# EAGLE board InkTime (EAGLE 9.7.0)
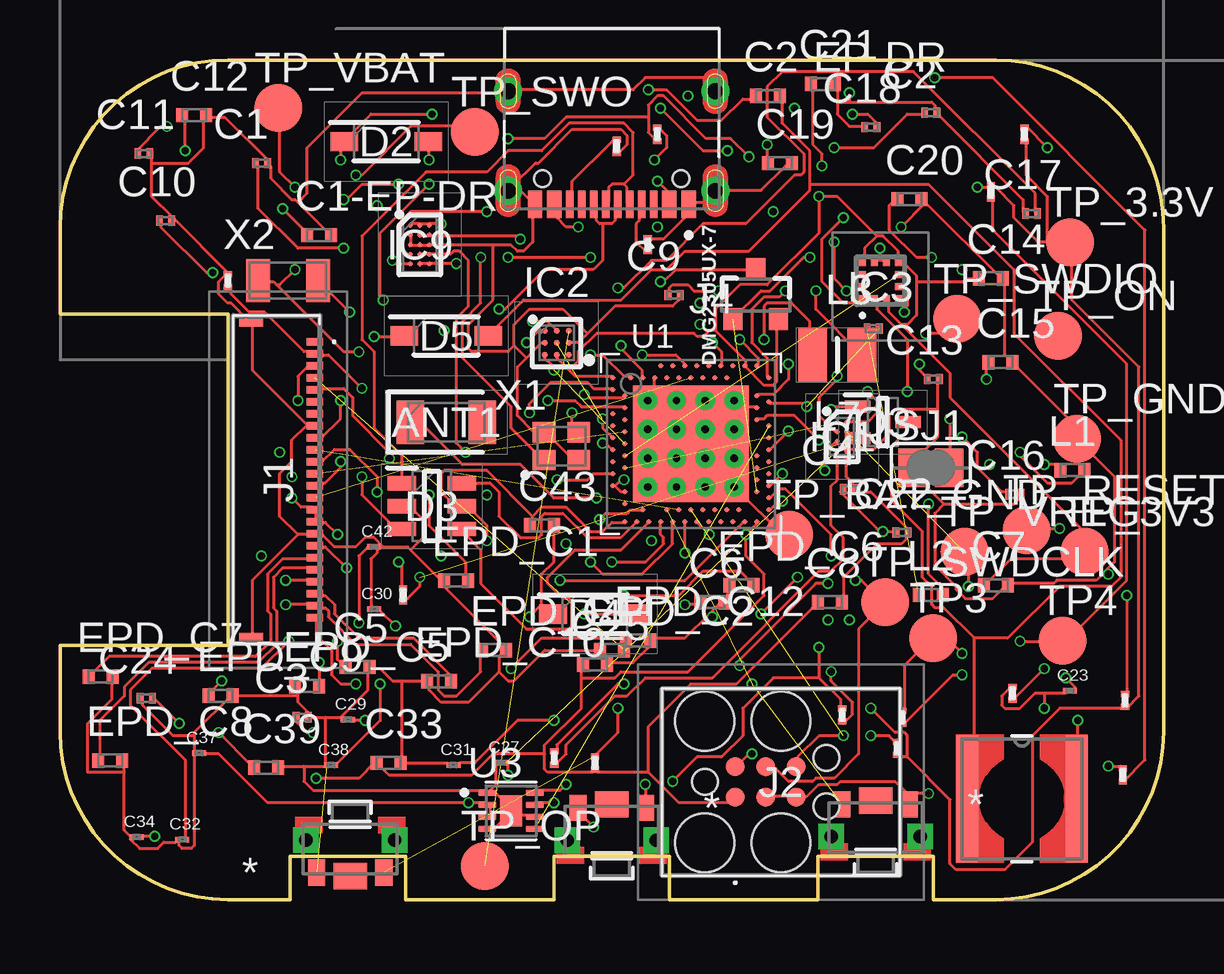
[diagram p2: board, top side]
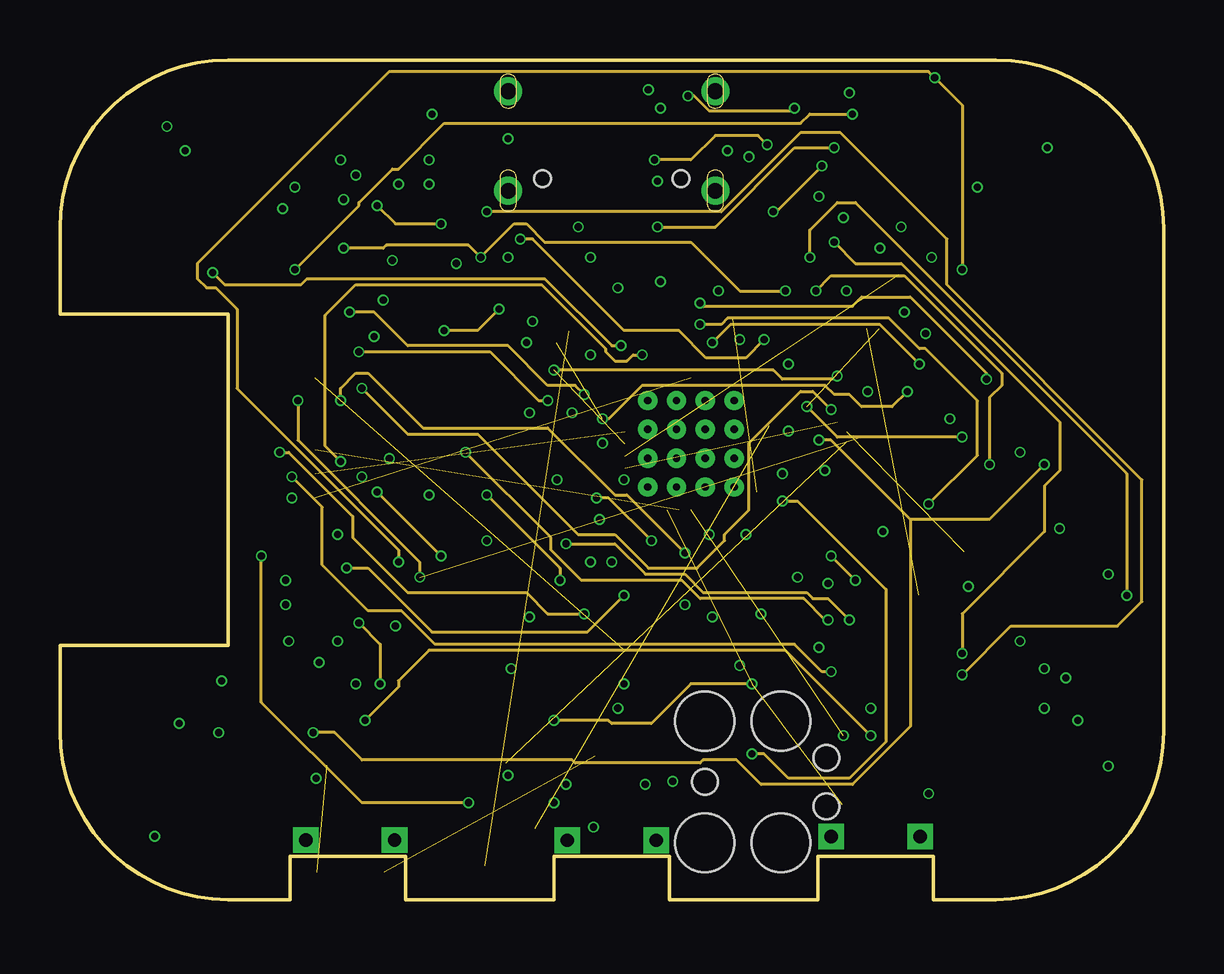
[diagram p3: board, inner layer Route15]
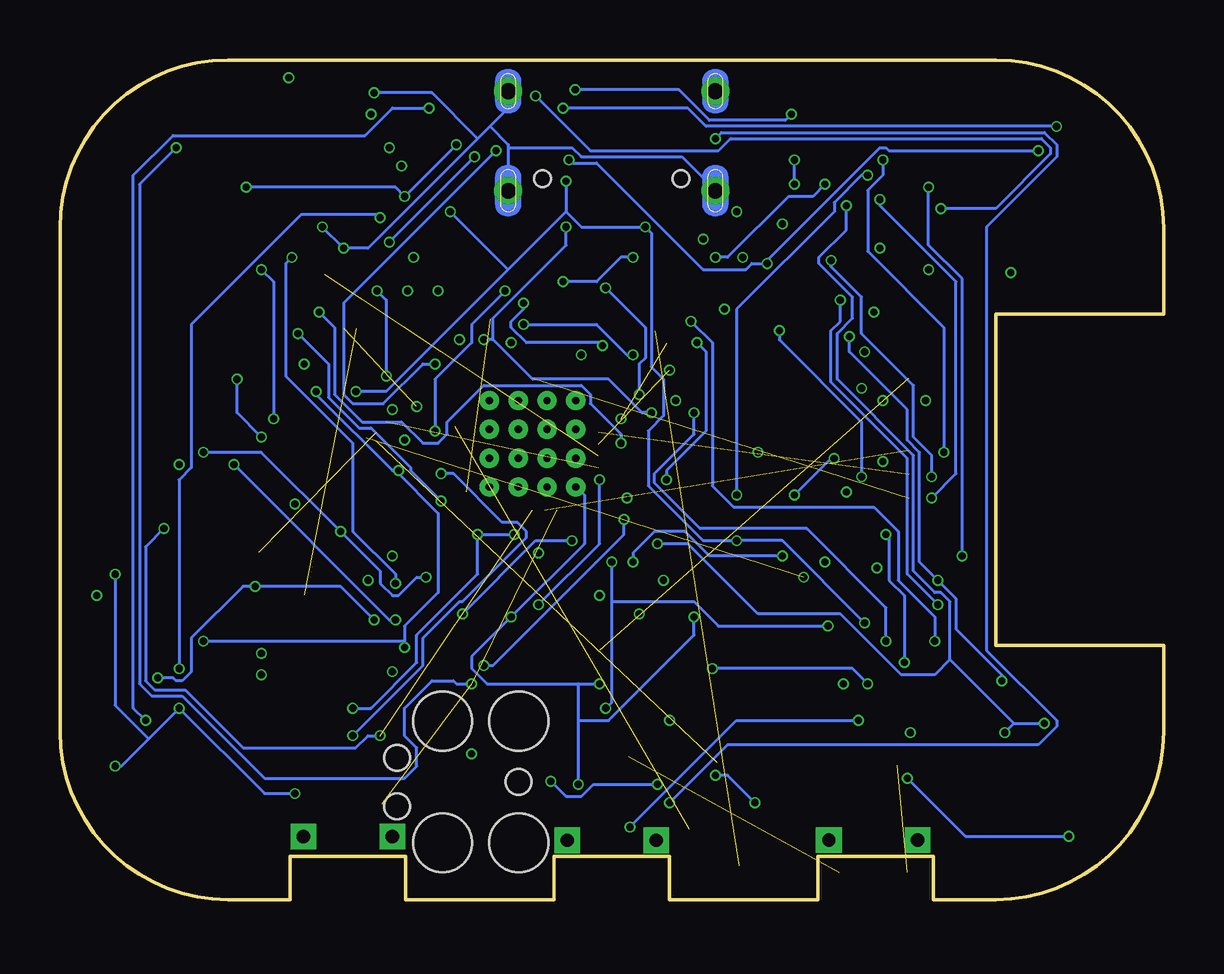
[diagram p4: board, bottom side, seen from below]

Size 46 x 35 mm. Coordinates in mm from the lower left corner, seen from the top.
Outline: 39,0 36.4,0 36.4,1.8 31.6,1.8 31.6,0 25.4,0 25.4,1.8 20.6,1.8 20.6,0 14.4,0 14.4,1.8 9.6,1.8 9.6,0 7,0 arc-90 0,7 0,10.6 7,10.6 7,24.4 0,24.4 0,28 arc-90 7,35 39,35 arc-90 46,28 46,7 arc-90 39,0
Copper layers (1+2*15+16): Top 0.035mm / dielectric 1.6mm / Route2 0.035mm / dielectric 0.15mm / Route15 0.035mm / dielectric 0.2mm / Bottom 0.035mm
Design rules "jlcpcb-2layers.dru *": minimum track width 5mil, minimum drill 0.2mm, track to track 5mil, track to pad 5mil, pad to pad 5mil, via to via 5mil, smd to smd 5mil, copper to edge 0.2mm, drill to drill 6mil, minimum pad ring 10mil, minimum via ring 3mil, stop-mask expansion 4mil, vias tented up to drill 999mm, thermal gap 10mil

## Footprints (pad centres in the part's own frame; a part is rotated, then mirrored left to right if it is on the bottom)
2450AT18B100E_ANTC3216X140N = smd 1.15 x 1.8: 1 -1.5,0; 2 1.5,0
NORDIC_NRF_3_RESC0201_L = smd 0.28 x 0.43: 1 -0.255,0; 2 0.255,0
NORDIC_NRF_3_RESC0402_L = smd 0.5 x 0.6: 1 -0.5,0; 2 0.5,0
GRM011R60J152KE01L_2_CAPC0201X13N = smd 0.22 x 0.23: 1 -0.185,0; 2 0.185,0
ESP32_C6_LIBRARY_5_SOD3716X135N = smd 1.15 x 0.8: 1 -1.75,0; 2 1.75,0
ESP32_C6_LIBRARY_3_SOT95P280X145-6N = smd 1.2 x 0.6: 1 -1.25,0.95; 2 -1.25,0; 3 -1.25,-0.95; 4 1.25,-0.95; 5 1.25,0; 6 1.25,0.95
ESP32_C6_LIBRARY_4_ESP32_C6_LIBRARY_4_ESP32_C6_LIBRARY_4_ESP32_C6_LIBRARY_4_ESP32_WROVER_SPARKFUN-DISCRETESEMI_SOT23-3 = smd 0.8 x 0.9: 1 -0.95,-1; 2 0.95,-1; 3 0,1.1
BQ25180YBGR_BGA8C40P2X4_100X155X50 = smd 0.2 x 0.2: A1 -0.2,0.6; A2 0.2,0.6; B1 -0.2,0.2; B2 0.2,0.2; C1 -0.2,-0.2; C2 0.2,-0.2; D1 -0.2,-0.6; D2 0.2,-0.6
DRV2605YZFR_BGA9C50P3X3_144X144X62 = smd 0.25 x 0.25: A1 -0.5,0.5; A2 0,0.5; A3 0.5,0.5; B1 -0.5,0; B2 0,0; B3 0.5,0; C1 -0.5,-0.5; C2 0,-0.5; C3 0.5,-0.5
BMA423_BMA423 = smd 0.3 x 0.35: 1 -0.75,-0.775; 2 -0.25,-0.775; 3 0.25,-0.775; 4 0.75,-0.775; 7 0.75,0.775; 8 0.25,0.775; 9 -0.25,0.775; 10 -0.75,0.775 | smd 0.35 x 0.3: 5 0.775,-0.25; 6 0.775,0.25; 11 -0.775,0.25; 12 -0.775,-0.25
RT6160AWSC_BGA15C40P3X5_140X230X60 = smd 0.216 x 0.216: A1 -0.4,0.8; A2 0,0.8; A3 0.4,0.8; B1 -0.4,0.4; B2 0,0.4; B3 0.4,0.4; C1 -0.4,0; C2 0,0; C3 0.4,0; D1 -0.4,-0.4; D2 0,-0.4; D3 0.4,-0.4; E1 -0.4,-0.8; E2 0,-0.8; E3 0.4,-0.8
503480-2400_5034802400 = smd 0.3 x 0.7: 1 -5.75,1.525; 2 -5.25,1.525; 3 -4.75,1.525; 4 -4.25,1.525; 5 -3.75,1.525; 6 -3.25,1.525; 7 -2.75,1.525; 8 -2.25,1.525; 9 -1.75,1.525; 10 -1.25,1.525; 11 -0.75,1.525; 12 -0.25,1.525; 13 0.25,1.525; 14 0.75,1.525; 15 1.25,1.525; 16 1.75,1.525; 17 2.25,1.525; 18 2.75,1.525; 19 3.25,1.525; 20 3.75,1.525; 21 4.25,1.525; 22 4.75,1.525; 23 5.25,1.525; 24 5.75,1.525 | smd 0.3 x 1: MP1 -6.54,-1.125; MP2 6.54,-1.125
TC2030-IDC_TC2030IDC = smd 0.783 x 0.783: 1 -0.953,-0.635; 2 -0.953,0.635; 3 0.317,-0.635; 4 0.317,0.635; 5 1.588,-0.635; 6 1.588,0.635 | hole 2.451: -2.223,-2.54; -2.223,2.54; 0.952,-2.54; 0.952,2.54 | hole 1.067: -2.223,0; 2.857,-1.016; 2.857,1.016
KH-TYPE-C-16P_KINGHELM_KH-TYPE-C-16P = smd 0.6 x 1.15: A1_B12 -3.2,4.725; A4_B9 -2.4,4.725; A9_B4 2.4,4.725; A12_B1 3.2,4.725 | smd 0.3 x 1.15: A5 -1.25,4.725; A6 -0.25,4.725; A7 0.25,4.725; A8 1.25,4.725; B5 1.75,4.725; B6 0.75,4.725; B7 -0.75,4.725; B8 -1.75,4.725 | drill 0.65 pad 1.05: SH1 -4.32,0; SH2 4.32,0; SH3 -4.32,4.15; SH4 4.32,4.15 | hole 0.7: -2.89,3.65; 2.89,3.65
NORDIC_NRF_2_RESC0402_L = smd 0.5 x 0.6: 1 -0.5,0; 2 0.5,0
NORDIC_NRF_2_RESC0201_L = smd 0.28 x 0.43: 1 -0.255,0; 2 0.255,0
ESP32_C6_LIBRARY_2_IND_4828-WE-TPC_WRE = smd 0.9 x 5.3: 1 -2.286,0; 2 2.286,0
MLP2016SR47MT0S1_INDC2016X100N = smd 1.2 x 2.2: 1 -1.028,0; 2 1.028,0
ESP32_C6_LIBRARY_6_SOT65P210X110-3N = smd 1.05 x 0.5: 1 -1.05,0.65; 2 -1.05,-0.65; 3 1.05,0
CPF0201D7K68C1_0201 = smd 0.35 x 0.25: 1 0,0.275; 2 0,-0.275
ERA-1AEB3401C_0201 = smd 0.35 x 0.25: 1 0,0.275; 2 0,-0.275
ESP32_C6_LIBRARY_7_JUMPER_SJ = smd 1.168 x 1.6: 1 -0.762,0; 2 0.762,0
2025-10-22_07-23-44_LIBRARY_SW_EVP-AKE31A_PAN = smd 0.711 x 1.092: 1 -1.4,-0.972; 2 1.4,-0.972 | drill 0.559 pad 0.914 square: 3 -1.848,0.381; 4 1.848,0.381 | smd 1.397 x 1.092: 5 0,-1.124
HECTOR_WATCH_1_TP20R = smd 2 x 2: TP 0,0
NORDIC_NRF_4_AQFN50P700X700X85_HS-74N = smd 4.85 x 4.85: P$74 0,0 | drill 0.3 pad 0.6: P$75 -1.8,1.8; P$76 -0.6,1.8; P$77 0.6,1.8; P$78 1.8,1.8; P$79 -1.8,0.6; P$80 -0.6,0.6; P$81 0.6,0.6; P$82 1.8,0.6; P$83 -1.8,-0.6; P$84 -0.6,-0.6; P$85 0.6,-0.6; P$86 1.8,-0.6; P$87 -1.8,-1.8; P$88 -0.6,-1.8; P$89 0.6,-1.8; P$90 1.8,-1.8 | smd 0.2 x 0.2: P$A8 -1.25,3.25; P$A10 -0.75,3.25; P$A12 -0.25,3.25; P$A14 0.25,3.25; P$A16 0.75,3.25; P$A18 1.25,3.25; P$A20 1.75,3.25; P$A22 2.25,3.25; P$A23 2.75,3.25; P$AA24 3.25,-2.25; P$AB2 -2.75,-2.5; P$AC5 -2,-2.75; P$AC9 -1,-2.75; P$AC11 -0.5,-2.75; P$AC13 0,-2.75; P$AC15 0.5,-2.75; P$AC17 1,-2.75; P$AC19 1.5,-2.75; P$AC21 2,-2.75; P$AC24 3.25,-2.75; P$AD2 -2.75,-3.25; P$AD4 -2.25,-3.25; P$AD6 -1.75,-3.25; P$AD8 -1.25,-3.25; P$AD10 -0.75,-3.25; P$AD12 -0.25,-3.25; P$AD14 0.25,-3.25; P$AD16 0.75,-3.25; P$AD18 1.25,-3.25; P$AD20 1.75,-3.25; P$AD22 2.25,-3.25; P$AD23 2.75,-3.25; P$B1 -3.25,2.75; P$B3 -2.5,2.75; P$B5 -2,2.75; P$B7 -1.5,2.75; P$B9 -1,2.75; P$B11 -0.5,2.75; P$B13 0,2.75; P$B15 0.5,2.75; P$B17 1,2.75; P$B19 1.5,2.75; P$B24 3.25,2.75; P$C1 -3.25,2.25; P$D2 -2.75,2; P$D23 2.75,2; P$E24 3.25,1.75; P$F2 -2.75,1.5; P$F23 2.75,1.5; P$G1 -3.25,1.25; P$H2 -2.75,1; P$H23 2.75,1; P$J1 -3.25,0.75; P$J24 3.25,0.75; P$K2 -2.75,0.5; P$L1 -3.25,0.25; P$L24 3.25,0.25; P$M2 -2.75,0; P$N1 -3.25,-0.25; P$N24 3.25,-0.25; P$P2 -2.75,-0.5; P$P23 2.75,-0.5; P$R1 -3.25,-0.75; P$R24 3.25,-0.75; P$T2 -2.75,-1; P$T23 2.75,-1; P$U1 -3.25,-1.25; P$U24 3.25,-1.25; P$V23 2.75,-1.5; P$W1 -3.25,-1.75; P$W24 3.25,-1.75; P$Y2 -2.75,-2; P$Y23 2.75,-2
ESP32_C6_LIBRARY_SON50P200X200X80-9N = smd 0.76 x 0.27: 1 -0.985,0.75; 2 -0.985,0.25; 3 -0.985,-0.25; 4 -0.985,-0.75; 5 0.985,-0.75; 6 0.985,-0.25; 7 0.985,0.25; 8 0.985,0.75 | smd 0.9 x 1.3: 9 0,0
NORDIC_NRF_BT-XTAL_2016_N = smd 0.95 x 0.85: 1 -0.725,-0.575; 2 0.725,-0.575; 3 0.725,0.575; 4 -0.725,0.575
NORDIC_NRF_1_XTAL_3215_N = smd 1 x 1.8: 1 -1.25,0; 2 1.25,0

## Placement (x,y rotation side)
ANT1  2450AT18B100E  [2450AT18B100E_ANTC3216X140N]  16.1,19.9 0 top
C1  12pF  [NORDIC_NRF_3_RESC0201_L]  8.4,30.7 0 top
C1-EP-DR  10uF  [NORDIC_NRF_3_RESC0402_L]  10.8,27.7 0 top
C2  12pF  [NORDIC_NRF_3_RESC0201_L]  36.3,32.8 0 top
C2-EP-DR  4.7uF/25V  [NORDIC_NRF_3_RESC0402_L]  29.5,33.5 0 top
C3  1pF  [NORDIC_NRF_3_RESC0201_L]  10.1,7.6 0 top
C4  1pF  [NORDIC_NRF_3_RESC0201_L]  32.9,17.1 0 top
C5  100nF  [NORDIC_NRF_3_RESC0402_L]  12.4,9.7 0 top
C6  4.7uF  [NORDIC_NRF_3_RESC0402_L]  27.2,12.4 0 top
C7  100nF  [NORDIC_NRF_3_RESC0402_L]  39,13.1 0 top
C8  100nF  [NORDIC_NRF_3_RESC0402_L]  32.1,12.4 0 top
C9  820pF  [NORDIC_NRF_3_RESC0201_L]  25.6,25.2 0 top
C10  N.C.  [NORDIC_NRF_3_RESC0201_L]  4.4,28.3 0 top
C11  100pF  [NORDIC_NRF_3_RESC0201_L]  3.5,31.1 0 top
C12  100nF  [NORDIC_NRF_3_RESC0402_L]  5.6,32.7 0 top
C13  N.C.  [NORDIC_NRF_3_RESC0201_L]  36.4,21.7 0 top
C14  4.7uF  [NORDIC_NRF_3_RESC0402_L]  38.8,25.9 0 top
C15  1.0uF  [NORDIC_NRF_3_RESC0402_L]  39.2,22.4 0 top
C16  47nF  [NORDIC_NRF_3_RESC0201_L]  39.8,16.9 0 top
C17  12pF  [NORDIC_NRF_3_RESC0201_L]  40.5,28.6 0 top
C18  12pF  [NORDIC_NRF_3_RESC0201_L]  33.8,32.2 0 top
C19  100nF  [NORDIC_NRF_3_RESC0402_L]  30,30.7 0 top
C20  4.7uF  [NORDIC_NRF_3_RESC0402_L]  35.4,29.2 0 top
C21  4.7uF  [NORDIC_NRF_3_RESC0402_L]  31.8,34 0 top
C22  N.C.  [NORDIC_NRF_3_RESC0201_L]  35.1,15.3 0 top
C23  0.1uF  [GRM011R60J152KE01L_2_CAPC0201X13N]  42.1,8.7 0 top
C24  10uF  [NORDIC_NRF_3_RESC0201_L]  3.6,8.4 0 top
C25  22uF  [NORDIC_NRF_3_RESC0402_L]  22.3,9.8 0 top
C27  0.1uF  [GRM011R60J152KE01L_2_CAPC0201X13N]  18.4,5.7 0 top
C29  1uF  [GRM011R60J152KE01L_2_CAPC0201X13N]  12,7.5 0 top
C30  1uF  [GRM011R60J152KE01L_2_CAPC0201X13N]  13.1,12.1 0 top
C31  1uF  [GRM011R60J152KE01L_2_CAPC0201X13N]  16.4,5.6 0 top
C32  1uF  [GRM011R60J152KE01L_2_CAPC0201X13N]  5.1,2.5 0 top
C33  22uF  [NORDIC_NRF_3_RESC0402_L]  13.7,5.7 0 top
C34  0.1uF  [GRM011R60J152KE01L_2_CAPC0201X13N]  3.2,2.6 0 top
C37  1uF  [GRM011R60J152KE01L_2_CAPC0201X13N]  5.8,6.1 0 top
C38  1uF  [GRM011R60J152KE01L_2_CAPC0201X13N]  11.3,5.6 0 top
C39  10uF  [NORDIC_NRF_3_RESC0402_L]  8.6,5.5 0 top
C42  0.1uF  [GRM011R60J152KE01L_2_CAPC0201X13N]  13.1,14.7 0 top
C43  4.7uF  [NORDIC_NRF_3_RESC0402_L]  20.1,15.6 0 top
D2  MBR0530  [ESP32_C6_LIBRARY_5_SOD3716X135N]  13.6,31.6 0 top
D3  USBLC6-2SC6Y  [ESP32_C6_LIBRARY_3_SOT95P280X145-6N]  15.5,16.4 0 top
D4  MBR0530  [ESP32_C6_LIBRARY_5_SOD3716X135N]  22.3,11.9 0 top
D5  MBR0530  [ESP32_C6_LIBRARY_5_SOD3716X135N]  16.1,23.5 0 top
DMG2305UX-7  20V/4.2A/52mΩ/1.4W  [ESP32_C6_LIBRARY_4_ESP32_C6_LIBRARY_4_ESP32_C6_LIBRARY_4_ESP32_C6_LIBRARY_4_ESP32_WROVER_SPARKFUN-DISCRETESEMI_SOT23-3]  29,25.2 0 top
EPD_C1  1uF/50V  [NORDIC_NRF_3_RESC0402_L]  16.5,13.3 0 top
EPD_C2  1uF/50V  [NORDIC_NRF_3_RESC0402_L]  23,10.4 0 top
EPD_C5  0.1uF/50V  [NORDIC_NRF_3_RESC0402_L]  10.3,8.9 0 top
EPD_C6  1uF/50V  [NORDIC_NRF_3_RESC0402_L]  28.4,13.1 0 top
EPD_C7  1uF/50V  [NORDIC_NRF_3_RESC0402_L]  1.7,9.3 0 top
EPD_C8  1uF/50V  [NORDIC_NRF_3_RESC0402_L]  2.1,5.8 0 top
EPD_C9  1uF/50V  [NORDIC_NRF_3_RESC0402_L]  6.7,8.5 0 top
EPD_C10  1uF/50V  [NORDIC_NRF_3_RESC0402_L]  15.8,9.1 0 top
EPD_C11  1uF/50V  [NORDIC_NRF_3_RESC0402_L]  18.1,10.4 0 top
EPD_C12  1uF/50V  [NORDIC_NRF_3_RESC0402_L]  24.1,10.8 0 top
IC1  BQ25180YBGR  [BQ25180YBGR_BGA8C40P2X4_100X155X50]  32.6,19.3 0 top
IC2  DRV2605YZFR  [DRV2605YZFR_BGA9C50P3X3_144X144X62]  20.7,23.2 0 top
IC3  BMA421  [BMA423_BMA423]  34.2,25.8 0 top
IC9  RT6160AWSC  [RT6160AWSC_BGA15C40P3X5_140X230X60]  15,27.3 0 top
J1  503480-2400  [503480-2400_5034802400]  9.1,17.5 270 top
J2  TC2030-IDC  [TC2030-IDC_TC2030IDC]  29.1,4.9 0 top
J4  KH-TYPE-C-16P  [KH-TYPE-C-16P_KINGHELM_KH-TYPE-C-16P]  23,33.7 180 top
L1  3.9nH  [NORDIC_NRF_2_RESC0402_L]  42.2,17.9 0 top
L2  10uH  [NORDIC_NRF_2_RESC0402_L]  36.3,12.7 0 top
L3  15nH  [NORDIC_NRF_2_RESC0201_L]  33.9,23.8 0 top
L5  68uH  [ESP32_C6_LIBRARY_2_IND_4828-WE-TPC_WRE]  40.1,4.2 0 top
L7  FTC252012SR47MBCA  [MLP2016SR47MT0S1_INDC2016X100N]  32.4,22.7 0 top
Q3  SI1308EDL-T1-GE3  [ESP32_C6_LIBRARY_6_SOT65P210X110-3N]  34.3,19.9 0 top
R1_EP_DR  0.47  [CPF0201D7K68C1_0201]  14.3,12.7 0 top
R1_USB  5K1  [CPF0201D7K68C1_0201]  24.5,27.3 0 top
R2  0  [CPF0201D7K68C1_0201]  32.6,7.7 0 top
R2_EP_DR  10K  [CPF0201D7K68C1_0201]  7,25.8 0 top
R2_USB  5K1  [CPF0201D7K68C1_0201]  23.2,31.4 0 top
R3  0  [ERA-1AEB3401C_0201]  39.7,8.6 0 top
R4  0  [CPF0201D7K68C1_0201]  35.1,7.6 0 top
R5  10k  [CPF0201D7K68C1_0201]  22.3,5.7 0 top
R7  10k  [CPF0201D7K68C1_0201]  34.9,6.3 0 top
R8  10k  [CPF0201D7K68C1_0201]  40.2,31.9 0 top
R9  10K  [CPF0201D7K68C1_0201]  20.6,5.9 0 top
R17  3K3  [CPF0201D7K68C1_0201]  24.9,31.9 0 top
R18  3K3  [CPF0201D7K68C1_0201]  38.8,29.5 0 top
R_PWR_EPD  10K  [CPF0201D7K68C1_0201]  44.4,8.3 0 top
R_TYPE_SEL  2.2  [CPF0201D7K68C1_0201]  44.3,5.2 0 top
SJ1  [ESP32_C6_LIBRARY_7_JUMPER_SJ]  36.3,18 0 top
SW1  2025-10-22_07-23-44_LIBRARY_EVP-AKE31ASW_EVP-AKE31A_PAN  [2025-10-22_07-23-44_LIBRARY_SW_EVP-AKE31A_PAN]  12.1,2.1 0 top
SW2  2025-10-22_07-23-44_LIBRARY_EVP-AKE31ASW_EVP-AKE31A_PAN  [2025-10-22_07-23-44_LIBRARY_SW_EVP-AKE31A_PAN]  34,3 180 top
SW3  2025-10-22_07-23-44_LIBRARY_EVP-AKE31ASW_EVP-AKE31A_PAN  [2025-10-22_07-23-44_LIBRARY_SW_EVP-AKE31A_PAN]  23,2.85 180 top
TP3  HECTOR_WATCH_1_TPTP20R  [HECTOR_WATCH_1_TP20R]  36.4,10.9 0 top
TP4  HECTOR_WATCH_1_TPTP20R  [HECTOR_WATCH_1_TP20R]  41.8,10.8 0 top
TP_3.3V  HECTOR_WATCH_1_TPTP20R  [HECTOR_WATCH_1_TP20R]  42.1,27.4 0 top
TP_3V3  HECTOR_WATCH_1_TPTP20R  [HECTOR_WATCH_1_TP20R]  42.7,14.5 0 top
TP_BAT_GND  HECTOR_WATCH_1_TPTP20R  [HECTOR_WATCH_1_TP20R]  30.4,15.2 0 top
TP_GND  HECTOR_WATCH_1_TPTP20R  [HECTOR_WATCH_1_TP20R]  42.4,19.2 0 top
TP_ON  HECTOR_WATCH_1_TPTP20R  [HECTOR_WATCH_1_TP20R]  41.6,23.5 0 top
TP_OP  HECTOR_WATCH_1_TPTP20R  [HECTOR_WATCH_1_TP20R]  17.7,1.4 0 top
TP_RESET  HECTOR_WATCH_1_TPTP20R  [HECTOR_WATCH_1_TP20R]  40.3,15.4 0 top
TP_SWDCLK  HECTOR_WATCH_1_TPTP20R  [HECTOR_WATCH_1_TP20R]  34.4,12.4 0 top
TP_SWDIO  HECTOR_WATCH_1_TPTP20R  [HECTOR_WATCH_1_TP20R]  37.4,24.2 0 top
TP_SWO  HECTOR_WATCH_1_TPTP20R  [HECTOR_WATCH_1_TP20R]  17.3,32 0 top
TP_VBAT  HECTOR_WATCH_1_TPTP20R  [HECTOR_WATCH_1_TP20R]  9.1,33 0 top
TP_VREG  HECTOR_WATCH_1_TPTP20R  [HECTOR_WATCH_1_TP20R]  37.7,14.5 0 top
U1  NRF52840_QF  [NORDIC_NRF_4_AQFN50P700X700X85_HS-74N]  26.3,19 0 top
U3  MAX17048G+T10  [ESP32_C6_LIBRARY_SON50P200X200X80-9N]  18.8,3.7 0 top
X1  32MHz  [NORDIC_NRF_BT-XTAL_2016_N]  20.9,18.9 0 top
X2  32.768kHz  [NORDIC_NRF_1_XTAL_3215_N]  9.5,25.8 0 top

## Tracks (layer width: path | path; a pad name or v marks a point on that pad's centre or on a via)
3V3  (via drill 0.3)
  Top 0.127: v3.95,2.64 3.44,2.64 C34.2 | v10.68,5.05 12.46,5.05 13.09,5.69 C33.1 13.22,5.69 13.73,5.18 17.16,5.18 18.05,6.07 20.21,6.07 | v27.06,15.21 26.56,15.72 U1.P$AD14 | U1.P$AD23 29.1,15.72 v28.59,15.21 28.59,14.32 29.35,13.56 29.35,12.67 26.18,9.5 23.38,9.5 23.13,9.24 21.73,9.24 | 24.52,5.31 22.36,5.31 R5.2 22.24,5.31 20.33,5.31 20.21,5.44 20.21,6.07 | 24.52,5.31 25.79,4.04 27.95,4.04 28.08,4.16 J2.1 | 21.73,9.24 21.73,7.97 20.21,6.45 20.21,6.07 | 21.73,9.24 21.73,9.75 C25.1 | 24.52,5.31 24.52,7.21 26.3,8.99 28.21,8.99 31.51,12.29 C8.1 | 41.16,27.41 42.05,27.41 TP_3.3V.TP | 41.16,27.41 40.78,27.41 39.76,28.42 39.76,28.93 39,29.69 38.88,29.69 R18.1 38.75,29.69 v38.24,29.69 | 41.16,27.41 41.16,29.31 40.27,30.2 40.27,31.6 R8.2 | 41.16,27.41 TP_3.3V.TP | 35.32,5.94 34.94,5.94 R7.2 | 35.32,5.94 37.1,4.16 37.1,1.5 37.35,1.24 39.38,1.24 40.53,2.39 40.53,6.83 41.67,7.97 44.34,7.97 R_PWR_EPD.2 44.46,7.97 44.97,8.48 44.97,22.2 42.18,24.99 42.18,27.28 TP_3.3V.TP | IC9.E2 15,26.52 15.38,26.52 IC9.E3 15.51,26.52 v16.52,26.52 | v24.78,30.84 25.29,31.34 25.29,31.85 24.91,32.23 R17.1 | v5.22,31.22 5.22,32.61 C12.1 | 21.22,22.07 20.71,22.58 IC2.C2 | 21.22,22.07 21.48,21.82 23,21.82 U1.P$B1 | DMG2305UX-7.2 29.86,24.1 29.86,21.56 29.73,21.44 29.35,21.44 28.59,22.2 U1.P$A22 28.59,22.33 28.59,22.45 27.32,23.72 | 21.22,22.07 21.6,22.45 21.6,22.83 22.36,23.6 26.43,23.6 26.56,23.47 26.81,23.47 27.06,23.72 27.32,23.72 | C7.1 38.62,13.18 39.64,14.2 42.43,14.2 42.69,14.45 TP_3V3.TP 42.69,14.58 42.69,15.34 37.1,20.93 37.1,21.95 35.06,23.98 | 35.06,23.98 34.56,24.48 34.56,24.99 IC3.3
  Top 0.127: 35.06,23.98 35.32,23.98 35.7,24.36 35.7,25.76 | 35.7,25.76 35.7,26.01 35.06,26.64 IC3.7 34.94,26.64 34.94,27.02 34.3,27.66 34.05,27.66 | 34.05,27.66 33.54,27.15 33.54,26.64 IC3.10 | 35.7,25.76 37.73,25.76 37.86,25.88 38.24,25.88 C14.1 | v29.48,31.47 29.48,30.71 C19.1 | 34.05,27.66 32.4,29.31 v31.64,29.31 31.64,27.79 29.48,25.63 28.33,25.63 27.32,24.61 27.32,23.72 | v33.8,7.97 34.81,6.96 35.19,6.96 35.32,6.83 35.32,5.94
  Route15 0.127: v24.78,30.84 26.3,30.84 27.32,31.85 29.1,31.85 v29.48,31.47
  Bottom 0.127: v3.95,2.64 8.27,2.64 v10.68,5.05 | v27.06,15.21 v28.59,15.21 28.59,13.56 31.13,11.02 31.13,9.88 33.03,7.97 v33.8,7.97 | 16.65,26.52 17.16,26.52 17.41,26.26 19.19,26.26 23.64,30.71 24.65,30.71 v24.78,30.84 | v5.22,31.22 11.44,31.22 11.57,31.34 11.82,31.34 16.65,26.52 | 16.65,26.52 v16.52,26.52 | v29.48,31.47 v31.64,29.31 32.02,29.69 v38.24,29.69
ALERT  (1 unrouted)
D+
  Top 0.127: U1.P$AD6 24.52,15.72 23.38,14.58 21.48,14.58 20.33,13.44 20.33,13.18 20.97,12.55 21.22,12.55 21.35,12.42 21.35,11.4 21.22,11.28 19.44,11.28 17.54,13.18 17.54,14.58 16.78,15.34 D3.4
D-
  Top 0.127: U1.P$AD4 24.02,15.72 23.38,15.09 21.98,15.09 20.97,16.1 20.21,16.1 20.08,15.98 20.08,15.21 19.95,15.09 19.19,15.09 18.3,15.98 18.3,16.99 17.92,17.37 16.78,17.37 D3.6
DN
  Top 0.127: 23.51,29.82 23,29.82 22.87,29.69 22.87,29.06 J4.A7 | 23.51,29.82 23.64,29.69 23.64,29.06 J4.B7 | 23.51,29.82 23.89,30.2 23.89,31.98 23.51,32.36 21.22,32.36 20.08,31.22 18.68,31.22 17.79,30.33 15.25,30.33 12.59,27.66 12.59,23.34 13.09,22.83 13.09,19.66 14.24,18.52 14.24,17.37 D3.1
DP  (via drill 0.3)
  Top 0.127: 22.62,28.17 23,28.17 23.13,28.3 23.13,28.93 J4.A6 | 22.62,28.17 22.49,28.17 22.36,28.3 22.36,28.93 J4.B6 | v12.59,17.63 12.59,16.86 13.98,15.47 14.24,15.47 D3.3 | v18.3,24.61 18.55,24.61 20.21,26.26 22.24,26.26 22.62,26.64 22.62,28.17
  Route15 0.127: v16.02,23.72 17.41,23.72 v18.3,24.61
  Bottom 0.127: v12.59,17.63 12.59,19.91 16.02,23.34 v16.02,23.72
EPD_3V3  (via drill 0.3)
  Top 0.127: v10.81,9.88 10.81,8.99 EPD_C5.2 | v11.57,15.21 11.06,15.72 10.68,15.72 J1.16 10.68,15.85 10.68,16.23 J1.15 10.55,16.36 10.05,16.36 v9.66,16.74 | v25.03,25.76 25.16,25.76 25.67,26.26 28.97,26.26 DMG2305UX-7.3 | v18.68,26.77 v22.11,26.77 | v14.11,29.82 12.59,29.82 11.95,29.18 v11.82,29.18
  Bottom 0.127: v10.81,9.88 10.81,12.67 11.44,13.31 11.44,15.09 v11.57,15.21 | v25.03,25.76 23.64,25.76 22.62,26.77 v22.11,26.77 | v18.68,26.77 18.17,26.77 15.63,29.31 14.62,29.31 v14.11,29.82 | v11.82,29.18 11.82,28.93 8.65,25.76 8.65,17.75 v9.66,16.74
EPD_BUSY  (via drill 0.3)
  Top 0.127: v26.05,14.45 26.05,15.72 U1.P$AD12 | v11.7,20.8 11.7,20.04 10.94,19.28 10.68,19.28 J1.9
  Route15 0.127: v26.05,14.45 23.64,16.86 23.13,16.86 20.33,19.66 15.13,19.66 12.84,21.95 12.33,21.95 11.7,21.31 v11.7,20.8
EPD_CS  (1 unrouted)
EPD_DC  (via drill 0.3)
  Top 0.127: v22.11,14.07 22.62,13.56 24.27,13.56 25.54,14.83 25.54,15.72 U1.P$AD10 | v13.22,16.99 13.22,17.63 12.08,18.77 11.44,18.77 10.94,18.26 10.68,18.26 J1.11
  Route15 0.127: v13.22,16.99 v15.89,14.32
  Bottom 0.127: v22.11,14.07 22.11,14.45 21.22,15.34 19.95,15.34 18.94,14.32 v15.89,14.32
EPD_RST  (1 unrouted)
GDR  (via drill 0.3)
  Top 0.127: R2_EP_DR.2 7.12,25.5 7.12,25.25 7.89,24.48 8.52,24.48 10.17,22.83 10.55,22.83 J1.2 10.68,22.71 11.19,22.71 v12.59,21.31 | v32.14,20.42 32.27,20.55 33.16,20.55 Q3.1
  Route15 0.127: v32.14,20.42 31.38,21.18 30.87,21.18 28.71,19.02 28.71,16.23 27.7,15.21 27.7,14.96 26.56,13.82 24.52,13.82 23.13,15.21 21.6,15.21 17.41,19.41 14.49,19.41 v12.59,21.31
GND  (via drill 0.3)  (1 unrouted)
  Top 0.127: J2.3 29.48,4.29 30.62,4.29 J2.5 30.75,4.29 31.13,4.29 31.64,4.8 32.4,4.8 32.52,4.93 34.81,4.93 35.32,4.42 | 35.32,4.42 35.32,4.04 SW2.1 35.32,4.42 | 41.03,8.61 40.65,8.61 40.02,7.97 39.38,7.97 39.26,8.1 39.26,8.48 39.64,8.86 R3.1 | 41.03,8.61 41.92,8.61 C23.1 | v43.7,5.56 44.21,5.56 R_TYPE_SEL.1 | 41.03,8.61 v41.03,7.97 | v36.21,4.42 35.32,4.42 | C8.2 32.65,12.42 32.65,13.44 34.05,14.83 35.06,14.83 35.45,15.21 C22.2 35.32,15.34 35.32,15.47 33.8,16.99 33.16,16.99 C4.2 33.03,17.12 33.03,17.37 32.78,17.63 32.78,18.64 IC1.D2 32.78,18.77 33.92,18.77 34.56,19.41 34.56,20.17 34.81,20.42 36.59,20.42 | 36.59,20.42 36.59,19.28 35.57,18.26 35.57,18.01 SJ1.1 35.45,17.88 36.84,16.48 | 36.59,20.42 36.59,21.69 C13.2 | 36.84,16.48 39.76,16.48 40.02,16.74 40.02,16.86 C16.2 | 36.84,16.48 36.46,16.1 36.46,13.94 37.35,13.05 37.35,12.93 37.73,12.55 38.88,12.55 39.38,13.05 C7.2 39.51,13.18 41.41,13.18 41.54,13.31 43.19,13.31 43.57,13.69 | 36.08,29.06 39.26,25.88 C14.2 39.38,25.88 39.38,22.71 39.64,22.45 C15.2 39.76,22.33 42.3,19.79 42.3,19.28 TP_GND.TP 42.43,19.15 43.95,17.63 43.95,14.07 43.57,13.69 | 36.08,29.06 35.95,29.18 C20.2 36.08,29.06 | 43.57,13.69 v43.7,13.56 | 18.94,29.82 18.68,29.56 J4.SH4 18.94,29.82 | 18.94,29.82 19.82,30.71 19.95,30.71 21.35,32.11 23.38,32.11 23.64,31.85 23.64,31.47 23.38,31.22 23.25,31.22 R2_USB.2 | IC9.B1 14.62,27.66 14.62,27.41 IC9.C1 14.62,27.28 15,27.28 | 15,27.28 15.38,27.28 IC9.C3 15.51,27.28 18.05,27.28 | 15,27.28 IC9.C2 | 18.05,27.28 18.81,27.28 19.06,27.02 19.32,27.02 19.7,27.41 19.7,28.93 J4.A12_B1 19.7,29.06 18.94,29.82
  Top 0.127: 21.98,23.6 23.13,24.74 25.54,24.74 25.92,25.12 C9.2 | 21.98,23.6 21.6,23.21 21.22,23.21 IC2.B3 | 19.44,22.58 19.06,22.2 19.06,20.17 19.7,19.53 20.08,19.53 X1.4 20.21,19.53 21.35,18.39 21.6,18.39 X1.2 | 19.44,22.58 20.08,23.21 IC2.B1 | 21.98,23.6 20.97,24.61 19.57,24.61 18.94,23.98 18.94,23.09 | 19.44,22.58 18.94,23.09 | 18.05,27.28 18.05,24.99 17.03,23.98 17.03,22.96 17.16,22.83 18.68,22.83 18.94,23.09 | 32.4,33.25 32.4,33.88 C21.2 | 32.4,33.25 32.4,32.74 32.91,32.23 33.54,32.23 C18.1 | 32.4,33.25 32.91,33.25 | 32.91,33.25 36.34,33.25 36.46,33.12 36.46,32.87 C2.2 36.59,32.74 40.14,29.18 40.14,28.68 C17.1 | R1_USB.1 24.52,27.53 25.16,27.53 26.18,28.55 26.18,28.93 J4.A1_B12 26.3,29.06 26.94,29.06 27.32,29.44 J4.SH3 27.45,29.56 29.22,29.56 30.24,30.58 30.49,30.58 C19.2 | 34.18,26.64 34.43,26.64 IC3.8 | 34.18,26.64 34.05,26.64 IC3.9 | v34.18,27.15 34.18,26.64 | J4.SH1 27.32,33.76 26.81,34.26 24.4,34.26 23.89,33.76 18.68,33.76 J4.SH2 18.55,33.63 12.59,33.63 10.3,31.34 10.3,29.44 9.92,29.06 | v32.91,33.63 32.91,33.25 | v35.06,28.04 36.08,29.06 | 24.52,20.8 24.78,21.06 24.78,21.69 U1.P$B7 | 28.21,20.68 28.33,20.55 28.97,20.55 U1.P$F23 | 24.52,19.53 24.52,18.52 U1.P$83 | 24.52,19.53 U1.P$79 | 24.52,19.53 U1.P$74 | 24.52,20.8 U1.P$75 | 24.52,20.8 U1.P$74 | 26.81,17.25 25.79,17.25 U1.P$88 25.67,17.25 24.52,17.25 U1.P$87 | 26.81,17.25 U1.P$89 26.94,17.25 28.08,17.25 U1.P$90 28.21,17.12 30.11,15.21 30.37,15.21 TP_BAT_GND.TP | 26.81,17.25 U1.P$74 | U1.P$84 25.79,18.52 26.18,18.9 U1.P$74 | U1.P$85 26.81,18.39 26.56,18.14 U1.P$74 | U1.P$80 25.67,19.66 U1.P$74 | U1.P$81 26.94,19.53 U1.P$74
  Top 0.127: 28.08,19.53 28.08,18.52 U1.P$86 | 28.08,19.53 U1.P$82 | 28.08,19.53 U1.P$74 | U1.P$76 25.67,20.68 25.16,20.17 U1.P$74 | U1.P$77 26.94,20.68 27.57,20.04 U1.P$74 | 28.21,20.68 U1.P$78 | 28.21,20.68 U1.P$74 | 20.08,12.29 20.08,13.56 20.59,14.07 20.59,15.6 C43.2 | 20.08,12.29 20.46,11.91 D4.1 20.08,12.29 | v23.51,8.99 23.25,8.99 20.71,6.45 20.71,6.2 R9.1 | v24.4,4.8 24.4,3.91 SW3.1 | v19.57,11.79 20.08,12.29 | 2.68,5.31 2.68,2.89 2.93,2.64 C34.1 2.93,2.51 3.32,2.13 4.08,2.13 4.33,2.39 4.84,2.39 C32.1 4.97,2.39 4.97,2.26 5.09,2.13 5.47,2.13 5.6,2.26 5.6,6.07 C37.1 5.6,6.2 5.6,6.83 | 2.68,5.31 2.68,5.69 EPD_C8.2 | 2.68,5.31 1.16,5.31 1.16,7.34 2.17,8.36 2.17,9.24 EPD_C7.2 | C31.1 16.14,5.69 14.24,5.69 C33.2 14.24,5.82 14.24,9.12 | 14.24,9.12 13.86,9.12 13.35,9.63 12.97,9.63 C5.2 12.84,9.63 12.84,8.74 11.7,7.59 | 14.24,9.12 15.25,9.12 EPD_C10.1 15.38,8.99 15.38,8.74 15.89,8.23 17.03,8.23 18.3,9.5 | 5.6,6.83 5.6,6.96 7.12,8.48 EPD_C9.2 7.25,8.48 9.92,8.48 | 5.6,6.83 4.71,6.83 3.44,8.1 3.44,8.36 C24.1 | C27.1 18.17,5.69 18.17,4.8 17.92,4.55 U3.1 | 18.68,3.53 18.81,3.66 U3.9 | 18.68,3.53 18.17,3.02 17.92,3.02 U3.4 | 18.68,3.53 19.7,3.53 U3.6 | 18.68,3.53 U3.9 | U3.1 17.92,4.42 18.17,4.42 18.81,3.78 U3.9 | 10.17,5.56 9.16,5.56 C39.2 | 10.17,5.56 11.06,5.56 C38.1 11.06,5.69 11.06,7.59 | 11.06,7.59 10.43,7.59 C3.2 10.43,7.72 9.92,8.23 9.92,8.48 | 11.06,7.59 11.7,7.59 | 11.7,7.59 11.82,7.59 C29.1 | 9.92,8.48 9.92,8.86 EPD_C5.1 | 10.17,5.56 10.17,4.93 10.55,4.55 17.79,4.55 U3.1 | 9.92,29.06 9.79,29.18 9.66,29.18 8.78,30.07 8.78,30.58 C1.2 8.65,30.71 8.65,30.84 6.87,32.61 6.11,32.61 C12.2 5.98,32.61 5.98,31.34 5.35,30.71 3.82,30.71
  Top 0.127: 9.92,29.06 11.19,27.79 C1-EP-DR.2 | 4.71,28.42 7,26.14 R2_EP_DR.1 7,26.01 6.87,26.01 6.62,25.76 6.62,25.25 7,24.87 7.12,24.87 7.89,24.1 J1.MP1 8.01,23.98 8.01,22.07 10.3,19.79 | 3.82,30.71 3.82,29.31 4.71,28.42 | 3.82,30.71 3.82,31.09 C11.2 | 4.71,28.42 C10.2 | 10.3,19.79 10.55,19.79 J1.8 10.3,19.79 | EPD_C6.1 27.83,13.05 27.83,12.42 C6.2 27.7,12.29 27.45,12.29 27.06,11.91 | 27.06,11.91 26.05,10.9 24.65,10.9 EPD_C12.2 24.52,10.77 24.52,10.52 23.89,9.88 22.87,9.88 C25.2 22.75,9.88 22.62,10.01 22.62,10.39 EPD_C2.1 22.49,10.39 20.21,10.39 18.94,9.12 18.68,9.12 18.3,9.5 | C30.1 12.97,12.17 12.97,14.2 13.22,14.45 13.22,14.71 C42.2 13.35,14.71 13.47,14.71 | 14.62,14.58 14.49,14.71 13.47,14.71 | 14.62,14.58 15.89,13.31 EPD_C1.1 15.89,13.18 18.55,10.52 EPD_C11.2 18.55,10.39 18.3,10.13 18.3,9.5 | 13.47,14.71 13.09,15.09 12.71,15.09 12.33,14.71 11.44,14.71 10.94,15.21 10.68,15.21 J1.17 10.55,15.21 9.92,15.21 | 9.92,15.21 8.01,13.31 8.01,11.02 J1.MP2 | 14.62,14.58 15.13,15.09 15.13,15.85 14.62,16.36 14.36,16.36 D3.2 | 10.3,19.79 9.66,19.15 9.66,18.26 9.16,17.75 9.16,15.98 9.92,15.21 | 27.06,11.91 v27.19,11.79
  Bottom 0.127: v43.7,5.56 43.45,5.56 42.3,6.71 | 42.3,6.71 v41.03,7.97 37.48,4.42 v36.21,4.42 | 42.3,6.71 43.7,8.1 v43.7,13.56 | 28.08,32.23 27.45,32.87 27.45,33.63 J4.SH1 | 28.08,32.23 28.59,31.72 | 28.59,31.72 33.16,27.15 v34.18,27.15 v35.06,28.04 | 27.32,31.34 27.32,31.47 28.08,32.23 | 27.32,31.34 27.32,29.56 J4.SH3 | v32.91,33.63 30.49,33.63 28.59,31.72 | 27.32,31.34 24.65,31.34 24.27,30.96 20.08,30.96 18.68,29.56 J4.SH4 | 24.4,8.99 28.21,8.99 28.84,9.63 28.84,10.13 v27.19,11.79 24.14,14.83 24.14,16.86 24.4,17.12 U1.P$87 | 24.4,8.99 v23.51,8.99 | 24.4,8.99 24.4,7.47 | 24.4,7.47 v24.4,4.8 | v19.57,11.79 19.57,11.02 23.13,7.47 24.4,7.47
HAPTIC_EN  (via drill 0.3)
  Top 0.127: v20.71,17.5 21.98,17.5 22.24,17.75 23,17.75 U1.P$U1 | v19.44,23.21 19.95,23.72 20.08,23.72 IC2.A1
  Bottom 0.127: v20.71,17.5 20.71,17.88 19.06,19.53 19.06,22.83 v19.44,23.21
IMU_INT1  (via drill 0.3)
  Top 0.127: v22.62,19.02 22.75,19.02 23,18.77 U1.P$N1 | v35.19,24.48 35.19,24.61 35.32,24.74 35.32,25.37 35.06,25.63 IC3.5
  Bottom 0.127: v22.62,19.02 22.62,19.41 23.89,20.68 23.89,21.06 24.27,21.44 28.33,21.44 29.86,19.91 29.86,19.41 30.24,19.02 30.87,19.02 31.76,19.91 33.41,19.91 34.56,21.06 34.56,23.85 v35.19,24.48
IMU_INT2  (1 unrouted)
LX1  (via drill 0.3)
  Top 0.127: IC9.B2 15,27.66 15.38,27.66 IC9.B3 15.51,27.66 19.06,27.66 v19.19,27.53 | v29.35,23.34 29.35,24.74 29.48,24.87 30.49,24.87 31.26,24.1 31.26,22.71 L7.1
  Route15 0.127: v19.19,27.53 19.7,27.53 23.51,23.72 25.79,23.72 26.94,22.58 28.59,22.58 v29.35,23.34
LX2  (via drill 0.3)
  Top 0.127: IC9.D2 15.38,26.9 IC9.D3 15.51,26.9 16.27,26.9 16.4,27.02 16.65,27.02 17.03,26.64 17.03,24.74 16.52,24.23 16.52,19.02 v16.9,18.64 | v31.51,25.37 31.51,24.61 33.41,22.71 L7.2
  Route15 0.127: v16.9,18.64 20.46,15.09 20.46,14.58 21.73,13.31 25.92,13.31 26.68,12.55 31,12.55 31.89,11.66 v32.02,11.66 | v38.75,18.14 38.75,20.93 39.26,21.44 39.26,21.95 35.19,26.01 32.14,26.01 v31.51,25.37
  Bottom 0.127: v32.02,11.66 32.27,11.66 v38.75,18.14
MOSI  (1 unrouted)
N$1
  Top 0.127: IC1.D1 32.4,18.64 32.4,17.5 32.14,17.25 32.14,15.6 32.65,15.09 32.65,14.2 32.14,13.69 31.64,13.69 27.19,9.24 24.4,9.24 23.64,8.48 23.13,8.48 21.09,6.45 21.09,6.07 20.71,5.69 R9.2
N$2  (via drill 0.3)
  Top 0.127: 23.13,17.25 23.38,16.99 23.51,16.99 U1.P$Y2 | 23.13,17.25 23.38,17.5 v23.51,17.5 | v26.05,12.29 26.68,12.29 C6.1 | 23.13,17.25 U1.P$W1
  Bottom 0.127: v23.51,17.5 23.51,14.83 v26.05,12.29
N$3  (via drill 0.3)
  Top 0.127: v21.86,21.06 21.98,20.93 23.51,20.93 U1.P$D2 | v23.25,25.5 23.51,25.5 24.65,26.64 25.29,26.64 26.81,28.17 28.59,28.17 30.62,30.2 30.87,30.2 31,30.33 31,31.09 29.48,32.61 29.48,33.88 30.11,34.52 35.57,34.52 40.65,29.44 40.65,28.68 C17.2 | v12.08,24.48 10.81,25.76 X2.2
  Route15 0.127: v12.08,24.48 13.09,24.48 14.49,23.09 18.68,23.09 20.33,21.44 21.48,21.44 v21.86,21.06
  Bottom 0.127: v21.86,21.06 21.86,22.33 21.6,22.58 21.6,23.85 v23.25,25.5
N$4  (via drill 0.3)
  Top 0.127: v22.49,15.85 22.75,16.1 23.64,16.1 23.76,16.23 24.27,16.23 U1.P$AC5 | v28.33,9.75 28.33,10.01 31.51,13.18 v32.02,13.18 | v36.34,26.77 35.7,26.77 34.56,27.91 34.56,28.93 34.81,29.18 C20.1
  Bottom 0.127: v22.49,15.85 22.49,15.21 27.95,9.75 v28.33,9.75 | v32.02,13.18 32.02,13.56 33.8,15.34 33.8,19.02 36.59,21.82 36.59,26.52 v36.34,26.77
N$5  (via drill 0.3)
  Top 0.127: v20.33,20.8 21.48,20.8 21.73,20.55 23.51,20.55 U1.P$F2 | v12.46,22.83 11.82,22.83 9.03,25.63 | 9.03,25.63 8.9,25.76 8.27,25.76 X2.1 | v33.03,32.74 33.67,32.74 34.05,32.36 34.05,32.23 C18.2 | v9.79,26.26 9.16,25.63 9.03,25.63
  Route15 0.127: v20.33,20.8 19.95,20.8 17.92,22.83 v12.46,22.83 | v33.03,32.74 31.26,32.74 30.87,32.36 16.02,32.36 14.11,30.45 13.86,30.45 12.46,29.06 12.46,28.93 v9.79,26.26
N$6  (via drill 0.3)
  Top 0.127: v19.57,20.29 19.57,20.68 20.46,21.56 21.98,21.56 22.24,21.31 23,21.31 U1.P$C1 | v11.57,10.77 11.57,10.01 11.82,9.75 C5.1
  Bottom 0.127: v19.57,20.29 19.57,19.41 21.22,17.75 21.22,17.37 19.32,15.47 14.87,15.47 11.57,12.17 v11.57,10.77
N$7  (via drill 0.3)
  Top 0.127: v17.79,28.68 14.62,28.68 14.24,28.3 14.24,27.15 14.49,26.9 14.62,26.9 IC9.D1 | v37.61,9.37 37.22,9.37 35.19,7.34 R4.2
  Route15 0.127: v17.79,28.68 27.57,28.68 30.87,31.98 32.52,31.98 36.97,27.53 36.97,25.63 45.1,17.5 45.1,12.42 44.08,11.4 39.64,11.4 v37.61,9.37
N$8  (via drill 0.3)
  Top 0.127: C22.1 34.81,15.34 v34.3,15.34 34.18,15.34 32.52,16.99 C4.1 | v40.02,18.64 40.02,18.52 41.16,17.37 42.18,17.37 42.69,17.88 L1.2 | v22.36,16.74 20.59,16.74 19.19,18.14 16.78,18.14 15.13,19.79 14.62,19.79 ANT1.1 | v30.75,13.44 v29.22,11.91
  Route15 0.127: v22.36,16.74 22.87,16.74 v24.65,14.96
  Bottom 0.127: v40.02,18.64 37.61,18.64 v34.3,15.34 32.65,13.69 32.65,13.18 32.14,12.67 31.89,12.67 31.13,13.44 v30.75,13.44 | v24.65,14.96 26.18,14.96 v29.22,11.91
N$9  (via drill 0.3)
  Top 0.127: v13.86,26.64 13.98,26.52 14.62,26.52 IC9.E1 | v32.14,9.5 32.14,9.12 33.03,8.23 33.03,7.72 32.65,7.34 R2.2
  Route15 0.127: v9.66,17.63 10.94,16.36 10.94,13.94 12.84,12.04 14.24,12.04 15.63,10.64 30.62,10.64 31.76,9.5 v32.14,9.5
  Bottom 0.127: v13.86,26.64 13.86,26.39 12.59,25.12 12.59,23.6 10.43,21.44 10.43,19.28 9.66,18.52 v9.66,17.63
N$10  (via drill 0.3)
  Top 0.127: v22.11,22.71 22.62,22.71 23.51,21.82 23.76,21.82 U1.P$B3 | v36.21,16.48 36.21,13.56 36.72,13.05 36.72,12.8 L2.2
  Route15 0.127: v26.68,23.98 27.57,23.98 27.83,24.23 34.56,24.23 35.83,22.96 36.08,22.96 38.24,20.8 38.24,18.52 v36.21,16.48
  Bottom 0.127: v22.11,22.71 22.36,22.71 23.64,23.98 v26.68,23.98
N$11  (via drill 0.3)
  Top 0.127: v27.19,23.21 27.57,22.83 27.57,22.33 U1.P$A18 | v35.83,22.33 35.83,22.07 36.08,21.82 C13.1
  Route15 0.127: v27.19,23.21 27.95,23.98 34.18,23.98 v35.83,22.33
N$12  (via drill 0.3)
  Top 0.127: v28.33,23.34 29.1,22.58 29.1,22.33 U1.P$A23 | v21.35,20.29 21.35,19.79 21.6,19.53 X1.3 | v32.27,31.34 33.92,31.34 35.32,32.74 35.95,32.74 C2.1
  Route15 0.127: v32.27,31.34 30.62,31.34 27.32,28.04 v24.91,28.04
  Bottom 0.127: 27.95,23.34 v28.33,23.34 | 27.95,23.34 26.3,21.69 23.13,21.69 21.73,20.29 v21.35,20.29 | v24.91,28.04 24.91,27.28 27.95,24.23 27.95,23.34
N$13  (via drill 0.3)
  Top 0.127: v30.24,25.37 29.98,25.12 29.35,25.12 28.84,24.61 28.84,23.21 29.48,22.58 29.48,21.82 U1.P$B24 | v17.54,26.77 17.54,24.87 16.78,24.1 16.78,22.58 18.81,20.55 18.81,19.66 20.08,18.39 X1.1 | v11.82,27.15 9.92,27.15 8.27,28.8 8.27,30.58 C1.1
  Route15 0.127: v30.24,25.37 28.33,25.37 26.3,27.41 20.21,27.41 19.44,28.17 18.94,28.17 v17.54,26.77 17.03,27.28 13.6,27.28 13.47,27.15 v11.82,27.15
N$14  (via drill 0.3)
  Top 0.127: v30.37,22.33 30.37,21.69 29.73,21.06 29.1,21.06 U1.P$D23 | v27.83,31.22 26.81,31.22 v25.03,32.99 | v4.46,32.23 4.2,32.23 3.19,31.22 C11.1
  Bottom 0.127: v30.37,22.33 30.87,22.33 32.52,20.68 33.8,20.68 34.18,21.06 34.18,24.87 v27.83,31.22 | v25.03,32.99 19.82,32.99 19.06,32.23 v4.46,32.23
N$15  (via drill 0.3)  (1 unrouted)
  Top 0.127: v31.13,20.55 31,20.68 29.6,20.68 U1.P$E24 | v37.61,19.28 38.24,18.64 38.24,18.01 39.26,16.99 39.51,16.99 C16.1 | v38.62,21.69 38.62,22.33 C15.1 | v23.38,23.09 23.38,22.96 24.27,22.07 24.27,21.82 U1.P$B5 | v6.36,26.14 6.11,26.14 4.2,28.04 4.2,28.3 C10.1
  Route15 0.127: v31.13,20.55 32.4,19.28 v37.61,19.28 | v23.38,23.09 23,23.09 20.21,25.88 10.3,25.88 10.05,25.63 6.87,25.63 v6.36,26.14 | v38.62,21.69 38.62,21.95 35.45,25.12 33.41,25.12 33.03,24.74 26.81,24.74 v26.68,24.87
  Bottom 0.127: v38.62,21.69 38.62,20.29 v37.61,19.28 | v26.68,24.87 26.68,24.61 27.19,24.1 27.19,23.85 26.56,23.21 23.51,23.21 v23.38,23.09
N$16  (via drill 0.3)
  Top 0.127: v9.28,28.8 10.3,27.79 C1-EP-DR.1 | v42.43,7.47 42.43,4.29 L5.2
  Route15 0.127: v26.18,33.5 26.43,33.5 27.06,32.87 30.49,32.87 v30.62,32.99
  Bottom 0.127: v9.28,28.8 7,28.8 4.71,31.09 4.71,31.34 5.09,31.72 18.05,31.72 18.55,31.22 23.89,31.22 v26.18,33.5 | v30.62,32.99 32.14,32.99 33.29,31.85 41.29,31.85 42.94,30.2 42.94,7.97 v42.43,7.47
N$17  (via drill 0.3)
  Top 0.127: v31.64,19.15 30.62,20.17 29.48,20.17 29.35,20.04 29.1,20.04 U1.P$H23 | v41.03,18.14 41.54,18.14 41.67,18.01 L1.1 | v10.55,6.96 10.3,6.96 9.92,7.34 9.92,7.59 C3.1
  Route15 0.127: v31.64,19.15 32.14,19.15 35.45,15.85 | 35.45,15.85 38.75,15.85 v41.03,18.14 | v10.55,6.96 11.44,6.96 12.59,5.82 21.35,5.82 21.48,5.69 26.68,5.69 26.81,5.82 28.21,5.82 29.22,4.8 33.03,4.8 35.45,7.21 35.45,15.85
N$18
  Top 0.127: 38.11,10.9 36.84,12.17 36.46,12.17 36.34,12.29 36.34,13.05 35.95,13.44 35.95,15.34 34.68,16.61 34.68,18.9 35.32,19.53 35.32,19.79 Q3.3 | 38.11,10.9 38.11,4.55 37.86,4.29 L5.1 | 31.26,29.82 31.26,29.56 28.71,27.02 26.05,27.02 25.29,26.26 24.65,26.26 23.38,24.99 19.32,24.99 17.92,23.6 D5.2 | 31.26,29.82 31.26,31.22 30.11,32.36 30.11,33.38 C2-EP-DR.2 | 38.11,10.9 39.51,10.9 41.67,13.05 43.83,13.05 44.21,13.44 44.21,19.15 39.76,23.6 39.76,26.26 36.21,29.82 31.26,29.82
N$19  (via drill 0.3)
  Top 0.127: v24.52,33.76 25.29,33.76 26.56,32.49 27.57,32.49 28.46,33.38 28.97,33.38 C2-EP-DR.1 | v15.51,32.74 12.97,32.74 11.95,31.72 D2.1 11.82,31.6 11.7,31.47 v11.7,30.84 | v21.86,11.91 24.02,11.91 D4.2
  Route15 0.127: v21.86,11.91 20.33,11.91 19.44,12.8 14.49,12.8 12.21,15.09 12.21,15.98 9.54,18.64 v9.16,18.64
  Bottom 0.127: v24.52,33.76 20.21,33.76 18.94,32.49 15.76,32.49 v15.51,32.74 | v9.16,18.64 9.16,23.85 12.33,27.02 12.33,29.56 11.7,30.2 v11.7,30.84
N$20  (via drill 0.3)
  Top 0.127: v30.37,19.53 29.6,18.77 U1.P$N24 | v27.45,25.37 26.43,25.37 26.18,25.63 25.54,25.63 25.41,25.5 25.41,25.25 C9.1
  Bottom 0.127: v30.37,19.53 30.37,21.69 28.84,23.21 28.84,23.98 v27.45,25.37
N$21  (via drill 0.3)
  Top 0.127: v14.11,14.07 14.24,13.94 14.24,13.05 R1_EP_DR.1 | v36.46,34.26 38.88,34.26 45.23,27.91 45.23,5.82 44.34,4.93 R_TYPE_SEL.2 | v37.1,20.04 37.1,18.01 SJ1.2
  Route15 0.127: v14.11,14.07 14.11,14.58 7.38,21.31 7.38,24.61 6.49,25.5 6.11,25.5 5.73,25.88 5.73,26.52 13.73,34.52 36.21,34.52 v36.46,34.26 37.61,33.12 v37.61,26.26
  Bottom 0.127: v37.1,20.04 37.1,25.76 v37.61,26.26
N$22  (1 unrouted)
N$23  (via drill 0.3)
  Top 0.127: v15.38,16.86 15.38,15.6 16.9,14.07 16.9,13.31 EPD_C1.2 | v13.73,18.39 13.73,18.64 12.21,20.17 12.21,20.93 11.82,21.31 10.68,21.31 J1.5
  Bottom 0.127: v15.38,16.86 13.86,18.39 v13.73,18.39
N$24  (via drill 0.3)
  Top 0.127: v41.03,9.63 39.76,8.36 R3.2 | v32.65,28.42 31.76,27.53 31.76,25.76 32.65,24.87 33.29,24.87 33.41,24.99 IC3.1
  Bottom 0.127: v41.03,9.63 41.03,17.5 40.53,18.01 40.53,23.98 35.95,28.55 32.78,28.55 v32.65,28.42
N$26  (via drill 0.3)
  Top 0.127: v23.51,12.67 25.79,12.67 26.81,13.69 28.33,13.69 28.84,13.18 EPD_C6.2 | v11.95,13.82 11.06,14.71 10.68,14.71 J1.18
  Route15 0.127: v23.51,12.67 21.98,11.15 15.51,11.15 12.84,13.82 v11.95,13.82
N$27
  Top 0.127: EPD_C7.1 1.28,9.37 2.05,10.13 8.14,10.13 8.78,10.77 8.78,11.91 8.65,12.04 8.65,13.56 9.28,14.2 10.55,14.2 J1.19
N$28
  Top 0.127: EPD_C8.1 1.66,5.82 1.66,7.47 2.68,8.48 2.68,8.86 3.7,9.88 8.27,9.88 9.03,10.64 9.03,12.04 8.9,12.17 8.9,13.44 9.28,13.82 10.55,13.82 J1.20
N$29  (via drill 0.3)
  Top 0.127: v9.54,10.77 8.39,9.63 3.82,9.63 2.93,8.74 2.93,8.1 5.22,5.82 5.22,2.51 C32.2 | v19.7,24.1 20.33,24.1 20.71,23.72 IC2.A2
  Bottom 0.127: v9.54,10.77 9.54,11.79 11.06,13.31 11.06,15.34 12.08,16.36 17.92,16.36 18.81,17.25 18.81,23.21 v19.7,24.1
N$30
  Top 0.127: R1_USB.2 24.4,27.02 24.02,27.41 24.02,28.17 24.14,28.3 24.14,28.93 J4.A5
N$31
  Top 0.127: EPD_C10.2 16.27,9.12 16.27,9.37 14.74,10.9 12.46,10.9 11.44,11.91 11.44,12.29 11.06,12.67 10.68,12.67 J1.22
N$32  (1 unrouted)
N$33  (via drill 0.3)
  Top 0.127: v18.81,9.63 20.08,10.9 23.51,10.9 EPD_C12.1 | v12.33,8.99 11.7,8.99 11.32,9.37 11.32,10.39 10.68,11.02 10.68,11.66 J1.24
  Bottom 0.127: v18.81,9.63 12.97,9.63 v12.33,8.99
N$37
  Top 0.127: R2_USB.1 23.13,31.6 23,31.6 21.35,29.95 21.35,29.06 J4.B5
OUT+  (1 unrouted)
P0.13  (via drill 0.3)  (1 unrouted)
  Top 0.127: v23,14.07 24.4,14.07 25.16,14.83 25.16,15.09 25.03,15.21 25.03,15.72 U1.P$AD8 | v23.25,7.97 23.25,6.96 22.36,6.07 R5.1 | v13.98,11.4 13.35,12.04 C30.2
  Bottom 0.127: 23,12.42 23,8.23 v23.25,7.97 | 23,12.42 v23,14.07 | v13.98,11.4 18.55,11.4 19.57,12.42 23,12.42
P0.14  (via drill 0.3)  (2 unrouted)
  Top 0.127: v20.59,7.47 19.06,7.47 17.29,5.69 16.65,5.69 C31.2 | v41.16,31.34 40.27,32.23 R8.1
  Route15 0.127: v20.59,7.47 22.87,7.47 23,7.34 24.65,7.34 26.3,8.99 v28.84,8.99
  Bottom 0.127: v28.84,8.99 29.48,8.99 29.6,9.12 30.49,9.12 31.64,7.97 31.64,6.83 31.13,6.32 31.13,5.56 31.64,5.05 37.48,5.05 40.91,8.48 42.18,8.48 42.69,8.99 42.69,29.82 v41.16,31.34
P1.01  (via drill 0.3)  (1 unrouted)
  Top 0.127: v44.46,12.67 44.46,8.61 R_PWR_EPD.1 | v31.26,26.77 31,26.77 29.6,25.37 29.22,25.37 28.08,24.23 DMG2305UX-7.1
  Route15 0.127: v44.46,12.67 44.46,17.75 33.16,29.06 32.4,29.06 31.26,27.91 v31.26,26.77
P1.02  (via drill 0.3)
  Top 0.127: v12.71,7.47 12.21,7.47 C29.2 | v22.24,3.02 21.48,3.78 SW3.2 | v30.11,17.75 29.6,17.25 U1.P$W24 | v33.8,6.83 34.56,6.83 34.81,6.58 R7.1
  Route15 0.127: v12.71,7.47 14.11,8.86 14.11,9.12 15.38,10.39 30.24,10.39 v33.8,6.83
  Bottom 0.127: v12.71,7.47 17.79,7.47 v22.24,3.02 | v30.11,17.75 29.6,17.75 27.57,15.72 26.94,15.72 26.56,15.34 26.56,15.09 29.22,12.42 29.35,12.42 30.87,10.9 30.87,9.75 v33.8,6.83
PMIC_INT  (1 unrouted)
PREVGH  (via drill 0.3)
  Top 0.127: v6.74,9.12 6.24,8.61 EPD_C9.1 | v9.41,13.31 10.55,13.31 J1.21 | v13.09,23.47 14.24,23.47 D5.1
  Bottom 0.127: v6.74,9.12 6.74,9.37 8.65,11.28 8.65,12.55 v9.41,13.31 10.17,14.07 10.17,18.64 10.68,19.15 10.68,20.42 13.09,22.83 v13.09,23.47
PREVGL  (via drill 0.3)
  Top 0.127: EPD_C11.1 17.54,10.39 17.54,9.5 16.52,8.48 16.02,8.48 15.76,8.74 15.76,9.5 14.62,10.64 12.33,10.64 11.19,11.79 11.19,12.04 11.06,12.17 10.68,12.17 J1.23 10.55,12.29 v9.41,12.29 | v15.38,30.84 15.38,31.6 D2.2 | v15.38,29.82 13.35,27.79 13.35,25.12 v13.47,24.99
  Bottom 0.127: v15.38,29.82 v15.38,30.84 | v13.47,24.99 13.47,24.1 13.86,23.72 13.86,21.56 10.68,18.39 10.68,13.56 v9.41,12.29
RESE  (via drill 0.3)  (1 unrouted)
  Top 0.127: v15,13.44 15,13.05 14.49,12.55 14.36,12.55 R1_EP_DR.2 | v9.92,20.8 9.92,21.82 10.3,22.2 10.55,22.2 J1.3
  Route15 0.127: v15,13.44 15,14.07 9.92,19.15 v9.92,20.8
RESET  (via drill 0.3)  (1 unrouted)
  Top 0.127: v32.65,6.83 31.64,6.83 30.75,5.94 30.75,5.56 J2.6 | v41.67,15.47 40.4,15.47 TP_RESET.TP
  Bottom 0.127: v32.65,6.83 33.16,6.83 33.67,6.32 38.37,6.32 40.78,8.74 42.05,8.74 42.43,9.12 42.43,14.71 v41.67,15.47
SCK  (via drill 0.3)
  Top 0.127: v24.27,22.71 25.67,22.71 26.05,22.33 U1.P$A12 | v11.7,18.26 11.7,18.01 11.06,17.37 10.68,17.37 J1.13
  Route15 0.127: v24.27,22.71 23.89,22.71 23.64,22.45 23.13,22.45 22.75,22.83 22.75,22.96 20.08,25.63 12.33,25.63 11.06,24.36 11.06,18.9 v11.7,18.26
SCL  (via drill 0.3)  (1 unrouted)
  Top 0.127: R4.1 35.19,7.97 35.19,9.75 36.34,10.9 TP3.TP 36.46,10.9 36.97,10.9 v37.61,10.26 | v32.4,21.82 32.4,21.69 31.64,20.93 31.64,20.17 32.27,19.53 32.4,19.53 IC1.B1 | IC3.12 33.41,25.63 33.16,25.37 v32.78,25.37 32.27,25.88 v32.27,27.41 | v20.59,22.07 20.59,22.2 20.21,22.58 IC2.C1 | 24.52,32.61 24.52,33.12 24.91,33.5 25.16,33.5 26.94,31.72 27.95,31.72 v28.71,30.96 | 24.52,32.61 24.52,31.98 24.78,31.72 R17.2 | v20.59,4.04 19.82,4.04 U3.7 | v18.68,31.72 20.21,31.72 21.09,32.61 24.52,32.61
  Route15 0.127: v20.59,22.07 29.73,22.07 30.11,21.69 32.27,21.69 v32.4,21.82 | v37.61,10.26 37.61,11.91 41.03,15.34 41.03,17.25 41.67,17.88 41.67,19.91 35.06,26.52 33.16,26.52 v32.27,27.41
  Bottom 0.127: v32.4,21.82 32.4,24.99 v32.78,25.37 | v32.27,27.41 v28.71,30.96 | v20.59,4.04 18.17,6.45 5.22,6.45 4.46,7.21 4.46,7.47 7.38,10.39 7.38,28.04 4.46,30.96 4.46,31.47 4.97,31.98 18.43,31.98 v18.68,31.72
SDA  (via drill 0.3)  (1 unrouted)
  Top 0.127: R18.2 38.88,29.18 38.88,27.91 44.46,22.33 44.46,13.31 41.92,10.77 TP4.TP 41.8,10.77 v40.02,10.77 | v31.89,17.88 31.89,18.64 32.27,19.02 32.4,19.02 IC1.C1 | v35.32,21.18 35.32,23.34 34.05,24.61 34.05,24.99 IC3.2 | v22.62,20.04 22.62,19.66 23,19.28 U1.P$L1 | 31.64,9.24 32.52,8.36 32.52,7.97 R2.1 | v31.64,10.52 31.64,9.24 | v21.09,4.8 20.84,4.55 19.82,4.55 U3.8 | v25.54,4.93 26.56,5.94 27.57,5.94 28.46,6.83 28.46,7.97 29.73,9.24 31.64,9.24
  Route15 0.127: v22.62,20.04 22.87,20.04 24.27,21.44 31.89,21.44 32.27,21.06 32.91,21.06 33.41,20.55 34.68,20.55 v35.32,21.18
  Bottom 0.127: 32.02,17.88 32.14,17.88 35.32,21.06 v35.32,21.18 | 31.64,10.77 31.64,11.4 30.24,12.8 30.24,16.1 32.02,17.88 | 31.64,10.77 v31.64,10.52 | 32.02,17.88 v31.89,17.88 | v21.09,4.8 23.76,4.8 24.27,4.29 24.91,4.29 v25.54,4.93 | 31.64,10.77 v40.02,10.77
SWDCLK  (via drill 0.3)
  Top 0.127: v32.14,14.32 32.14,15.21 30.24,17.12 29.98,17.12 29.6,16.74 U1.P$AA24 | v33.16,13.31 33.41,13.31 34.3,12.42 TP_SWDCLK.TP 34.3,12.29 33.29,11.28 33.29,6.07 32.27,5.05 31.51,5.05 31.38,4.93 30.37,4.93 29.86,5.44 29.48,5.44 J2.4
  Route15 0.127: v33.16,13.31 v32.14,14.32
SWDIO  (via drill 0.3)
  Top 0.127: v30.11,16.61 29.98,16.61 29.6,16.23 U1.P$AC24 | v36.08,23.6 36.84,23.6 37.35,24.1 TP_SWDIO.TP | v28.84,6.07 28.71,6.07 28.21,5.56 J2.2
  Route15 0.127: v28.84,6.07 29.35,6.07 30.37,5.05 32.91,5.05 34.43,6.58 34.43,12.93 30.75,16.61 v30.11,16.61
  Bottom 0.127: v30.11,16.61 31.38,17.88 31.38,18.01 33.03,19.66 33.54,19.66 34.81,20.93 34.81,22.33 v36.08,23.6
SWO  (via drill 0.3)
  Top 0.127: v20.84,13.31 26.05,13.31 28.46,15.72 U1.P$AD22 | v12.33,30.2 12.59,30.2 14.62,32.23 17.16,32.23 17.29,32.11 TP_SWO.TP
  Route15 0.127: v20.84,13.31 20.84,13.82 v17.79,16.86
  Bottom 0.127: v17.79,16.86 17.79,24.61 13.73,28.68 13.73,29.06 12.59,30.2 v12.33,30.2
VBAT  (via drill 0.3)  (1 unrouted)
  Top 0.127: v18.68,5.18 18.68,5.69 C27.2 | C37.2 5.98,6.07 6.62,6.07 8.65,4.04 v17.03,4.04 17.79,4.04 U3.2 17.92,3.91 17.92,3.53 U3.3 | v9.79,29.69 9.16,30.33 9.16,32.99 TP_VBAT.TP
  Route15 0.127: v8.39,14.32 8.39,8.23 12.59,4.04 v17.03,4.04
  Bottom 0.127: v18.68,5.18 18.17,5.18 v17.03,4.04 | v9.79,29.69 9.79,27.28 8.39,25.88 v8.39,14.32
VBUS  (via drill 0.3)
  Top 0.127: 19.7,15.98 20.08,16.36 21.09,16.36 22.11,15.34 22.62,15.34 23,15.72 23.51,15.72 U1.P$AD2 | 19.7,15.98 19.7,15.72 C43.1 | 19.7,15.98 17.79,17.88 16.02,17.88 15.89,17.75 15.89,16.99 16.4,16.48 16.65,16.48 D3.5 16.78,16.36 17.03,16.36 17.79,15.6 v17.79,14.96 | v13.35,8.99 13.35,7.47 11.57,5.69 C38.2 | v12.46,11.53 12.46,14.32 12.84,14.71 C42.1 | v33.67,21.18 34.05,20.8 34.05,20.29 33.67,19.91 32.78,19.91 IC1.A2 | v24.91,29.95 25.29,29.56 25.29,29.06 J4.A4_B9 | v31.76,30.58 31.76,31.09 31.38,31.47 31.38,33.88 C21.1 | v21.6,28.04 21.09,28.04 20.71,28.42 20.71,28.93 J4.A9_B4
  Route15 0.127: v13.35,8.99 13.35,10.64 v12.46,11.53 | v31.76,30.58 29.86,28.68 v29.73,28.68
  Bottom 0.127: v12.46,11.53 15.89,14.96 v17.79,14.96 19.19,14.96 21.48,17.25 21.48,19.53 20.84,20.17 20.84,21.69 21.35,22.2 21.35,27.79 v21.6,28.04 24.27,28.04 24.91,28.68 | v33.67,21.18 32.4,21.18 27.32,26.26 | 24.91,28.68 27.32,26.26 | v24.91,29.95 24.91,28.68 | 27.32,26.26 v29.73,28.68
VREG  (via drill 0.3)  (1 unrouted)
  Top 0.127: v41.92,9.24 42.3,8.86 42.3,8.74 C23.2 | v37.86,13.05 37.86,14.32 37.73,14.45 TP_VREG.TP | 15,28.17 14.62,28.17 IC9.A1 | 15,28.17 15.38,28.17 | 15,28.17 IC9.A2 | v4.97,7.34 3.95,8.36 C24.2 | v6.62,6.96 8.01,5.56 C39.1 | v15.89,28.17 15.38,28.17 | 15.38,28.17 IC9.A3
  Route15 0.127: v15.89,28.17 13.98,28.17 v13.22,28.93 | v32.91,11.66 32.02,12.55 31.38,12.55 31.13,12.8 26.81,12.8 26.05,13.56 24.4,13.56 23.13,14.83 v21.09,14.83
  Bottom 0.127: v41.92,9.24 41.29,9.24 41.16,9.12 40.91,9.12 40.53,9.5 40.53,10.9 38.37,13.05 v37.86,13.05 34.3,13.05 v32.91,11.66 | 6.24,7.34 v4.97,7.34 | v6.62,6.96 6.24,7.34 | v13.22,28.93 13.22,27.91 14.36,26.77 14.36,26.52 12.97,25.12 12.97,24.23 13.6,23.6 13.6,21.69 10.43,18.52 10.43,13.69 9.54,12.8 9.28,12.8 8.9,12.42 8.9,10.01 | 6.24,7.34 8.9,10.01 | v21.09,14.83 19.82,14.83 16.9,11.91 13.47,11.91 10.94,9.37 9.54,9.37 8.9,10.01
(copper drawn outside any net)
  shapes: Bottom area x1